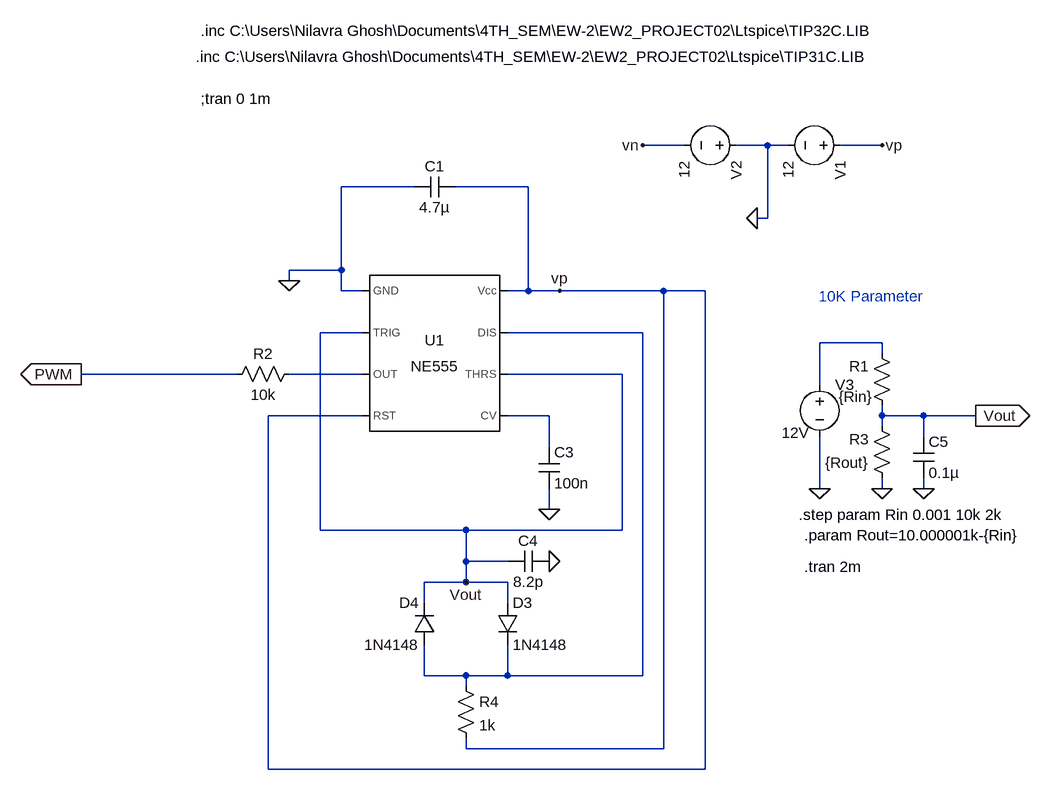
[diagram p0: schematic 555_timer.asc]
555_timer.asc, the LTspice schematic file:
Version 4
SHEET 1 1020 740
WIRE 448 -224 384 -224
WIRE 576 -224 528 -224
WIRE 608 -224 576 -224
WIRE 752 -224 688 -224
WIRE 32 -160 -80 -160
WIRE 208 -160 96 -160
WIRE 576 -112 576 -224
WIRE 576 -112 560 -112
WIRE -80 -32 -80 -160
WIRE -80 -32 -160 -32
WIRE -160 -16 -160 -32
WIRE -80 0 -80 -32
WIRE -48 0 -80 0
WIRE 208 0 208 -160
WIRE 208 0 176 0
WIRE 256 0 208 0
WIRE 416 0 256 0
WIRE 480 0 416 0
WIRE -48 64 -112 64
WIRE 384 64 176 64
WIRE 752 80 656 80
WIRE 752 96 752 80
WIRE -240 128 -480 128
WIRE -48 128 -160 128
WIRE 352 128 176 128
WIRE 656 144 656 80
WIRE -48 192 -192 192
WIRE 240 192 176 192
WIRE 752 192 752 176
WIRE 816 192 752 192
WIRE 896 192 816 192
WIRE 752 208 752 192
WIRE 816 224 816 192
WIRE 240 240 240 192
WIRE 656 304 656 224
WIRE 752 304 752 288
WIRE 816 304 816 288
WIRE 240 336 240 304
WIRE -112 368 -112 64
WIRE 112 368 -112 368
WIRE 352 368 352 128
WIRE 352 368 112 368
WIRE 112 416 112 368
WIRE 176 416 112 416
WIRE 112 448 112 416
WIRE 112 448 48 448
WIRE 176 448 112 448
WIRE 48 480 48 448
WIRE 176 480 176 448
WIRE 48 592 48 544
WIRE 112 592 48 592
WIRE 176 592 176 544
WIRE 176 592 112 592
WIRE 384 592 384 64
WIRE 384 592 176 592
WIRE 112 608 112 592
WIRE 112 704 112 688
WIRE 416 704 416 0
WIRE 416 704 112 704
WIRE -192 736 -192 192
WIRE 480 736 480 0
WIRE 480 736 -192 736
FLAG 560 -112 0
FLAG 752 -224 vp
FLAG 384 -224 vn
FLAG -160 -16 0
FLAG 240 336 0
FLAG 256 0 vp
FLAG 656 304 0
FLAG 752 304 0
FLAG -480 128 PWM
IOPIN -480 128 Out
FLAG 816 304 0
FLAG 896 192 Vout
IOPIN 896 192 Out
FLAG 240 416 0
FLAG 112 448 Vout
SYMBOL Misc\\NE555 64 96 R0
SYMATTR InstName U1
SYMBOL res -144 112 R90
WINDOW 0 0 56 VBottom 2
WINDOW 3 32 56 VTop 2
SYMATTR InstName R2
SYMATTR Value 10k
SYMBOL cap 96 -176 R90
WINDOW 0 0 32 VBottom 2
WINDOW 3 32 32 VTop 2
SYMATTR InstName C1
SYMATTR Value 4.7µ
SYMBOL voltage 704 -224 R90
WINDOW 123 0 0 Left 0
WINDOW 39 0 0 Left 0
SYMATTR InstName V1
SYMATTR Value 12
SYMBOL voltage 544 -224 R90
WINDOW 123 0 0 Left 0
WINDOW 39 0 0 Left 0
SYMATTR InstName V2
SYMATTR Value 12
SYMBOL cap 224 240 R0
SYMATTR InstName C3
SYMATTR Value 100n
SYMBOL voltage 656 128 R0
WINDOW 123 0 0 Left 0
WINDOW 39 0 0 Left 0
WINDOW 3 -58 90 Left 2
SYMATTR Value 12V
SYMATTR InstName V3
SYMBOL res 768 192 R180
WINDOW 0 36 76 Left 2
WINDOW 3 30 29 Left 2
SYMATTR InstName R1
SYMATTR Value {Rin}
SYMBOL res 768 304 R180
WINDOW 0 36 76 Left 2
WINDOW 3 36 40 Left 2
SYMATTR InstName R3
SYMATTR Value {Rout}
SYMBOL cap 800 224 R0
SYMATTR InstName C5
SYMATTR Value 0.1µ
SYMBOL cap 240 400 R90
WINDOW 0 0 32 VBottom 2
WINDOW 3 32 32 VTop 2
SYMATTR InstName C4
SYMATTR Value 8.2p
SYMBOL res 96 592 R0
SYMATTR InstName R4
SYMATTR Value 1k
SYMBOL diode 160 480 R0
SYMATTR InstName D3
SYMATTR Value 1N4148
SYMBOL diode 64 544 R180
WINDOW 0 24 64 Left 2
WINDOW 3 24 0 Left 2
SYMATTR InstName D4
SYMATTR Value 1N4148
TEXT -304 -360 Left 2 !.inc C:\\Users\\Nilavra Ghosh\\Documents\\4TH_SEM\\EW-2\\EW2_PROJECT02\\Ltspice\\TIP31C.LIB
TEXT -296 -400 Left 2 !.inc C:\\Users\\Nilavra Ghosh\\Documents\\4TH_SEM\\EW-2\\EW2_PROJECT02\\Ltspice\\TIP32C.LIB
TEXT 624 344 Left 2 !.step param Rin 0.001 10k 2k
TEXT 736 8 Center 2 ;10K Parameter
TEXT -296 -296 Left 2 !;tran 0 1m
TEXT 632 376 Left 2 !.param Rout=10.000001k-{Rin}
TEXT 632 424 Left 2 !.tran 2m

The netlist it stands for:
* 555_timer.asc
XU1 0 Vout N003 vp N004 Vout N001 vp NE555  ; pins GND TRIG OUT RST CV THRS DIS Vcc
R2 N003 PWM 10k
C1 vp 0 4.7µ
V1 vp 0 12
V2 0 vn 12
C3 N004 0 100n
V3 N002 0 12V
R1 Vout N002 {Rin}
R3 0 Vout {Rout}
C5 Vout 0 0.1µ
C4 0 Vout 8.2p
R4 N001 vp 1k
D3 Vout N001 1N4148
D4 N001 Vout 1N4148
.model D D
.lib standard.dio
.inc C:\Users\Nilavra Ghosh\Documents\4TH_SEM\EW-2\EW2_PROJECT02\Ltspice\TIP31C.LIB
.inc C:\Users\Nilavra Ghosh\Documents\4TH_SEM\EW-2\EW2_PROJECT02\Ltspice\TIP32C.LIB
.step param Rin 0.001 10k 2k
* 10K Parameter
;tran 0 1m
.param Rout=10.000001k-{Rin}
.tran 2m
.lib NE555.sub
.backanno
.end